# EasyEDA schematic scara_robot.json

## Sheets
1 Sheet_1: TITLE: SCARA 4DOF SCHEMATIC; REV: 3.1; Date: 13/06/2025; Sheet: 1/2; Drawn By: Lucas; Company: FEUP
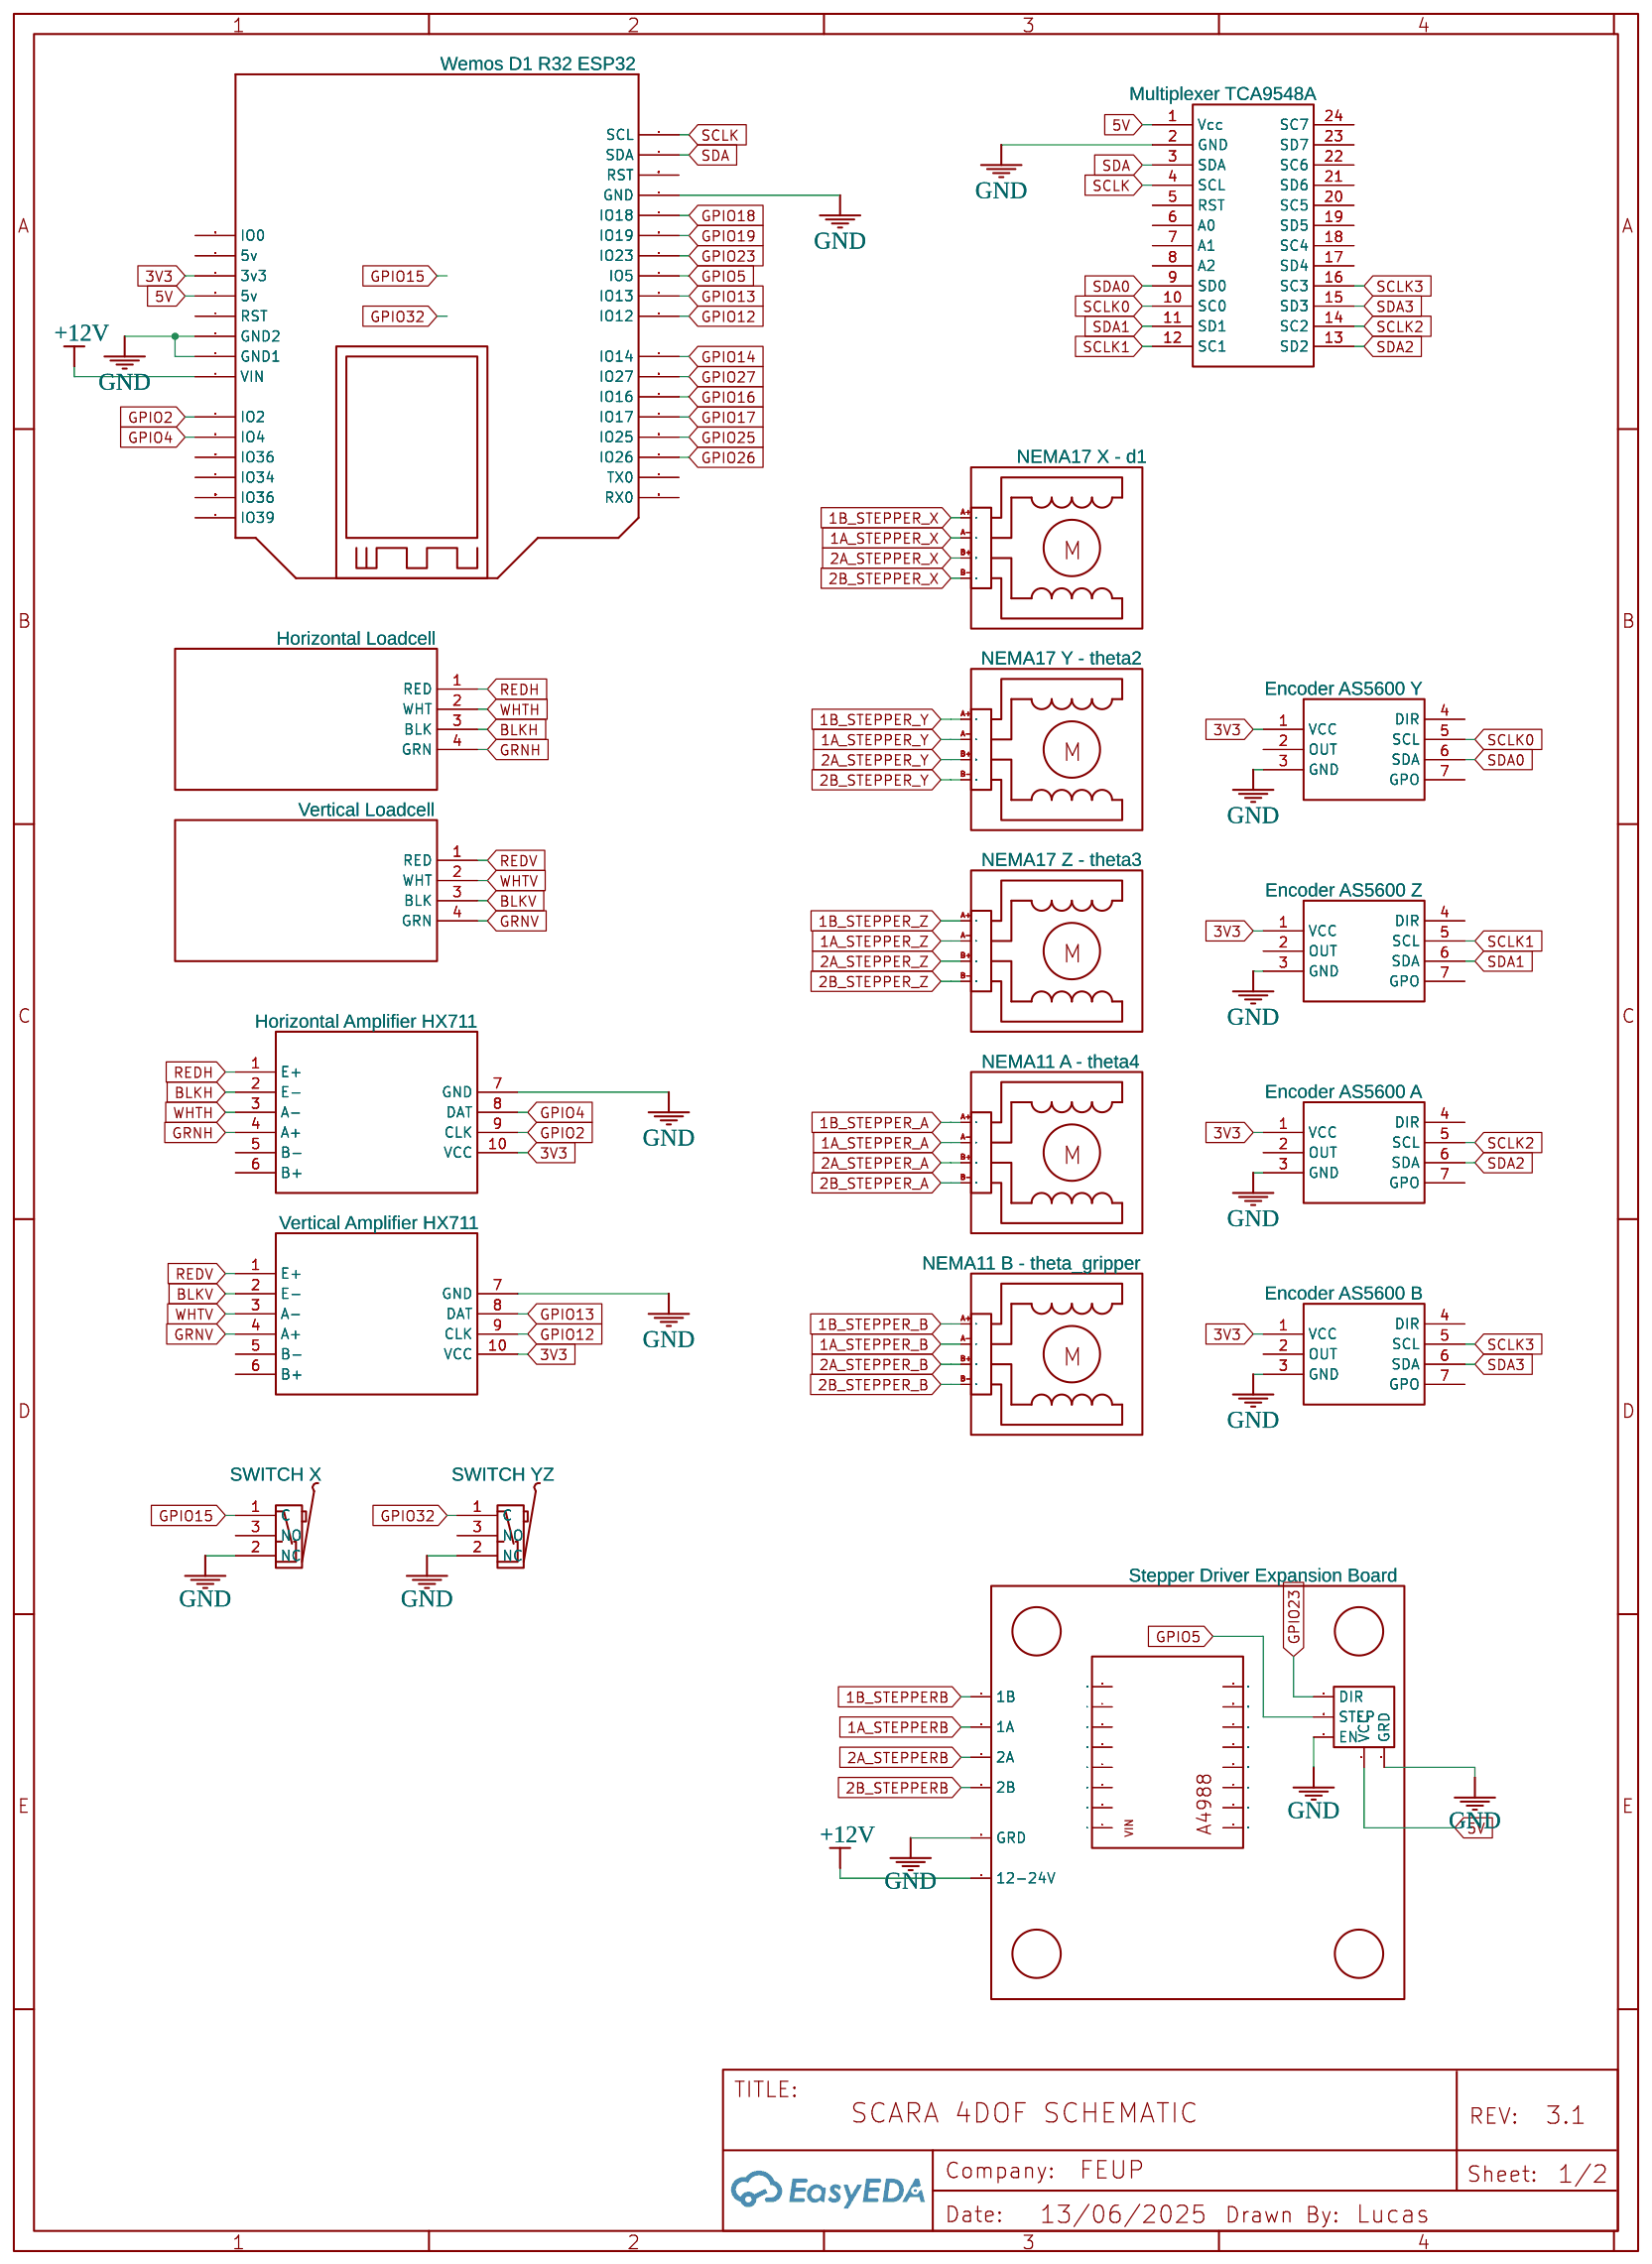
[diagram p0: Sheet_1]
2 Sheet_2: Sheet: 2/2
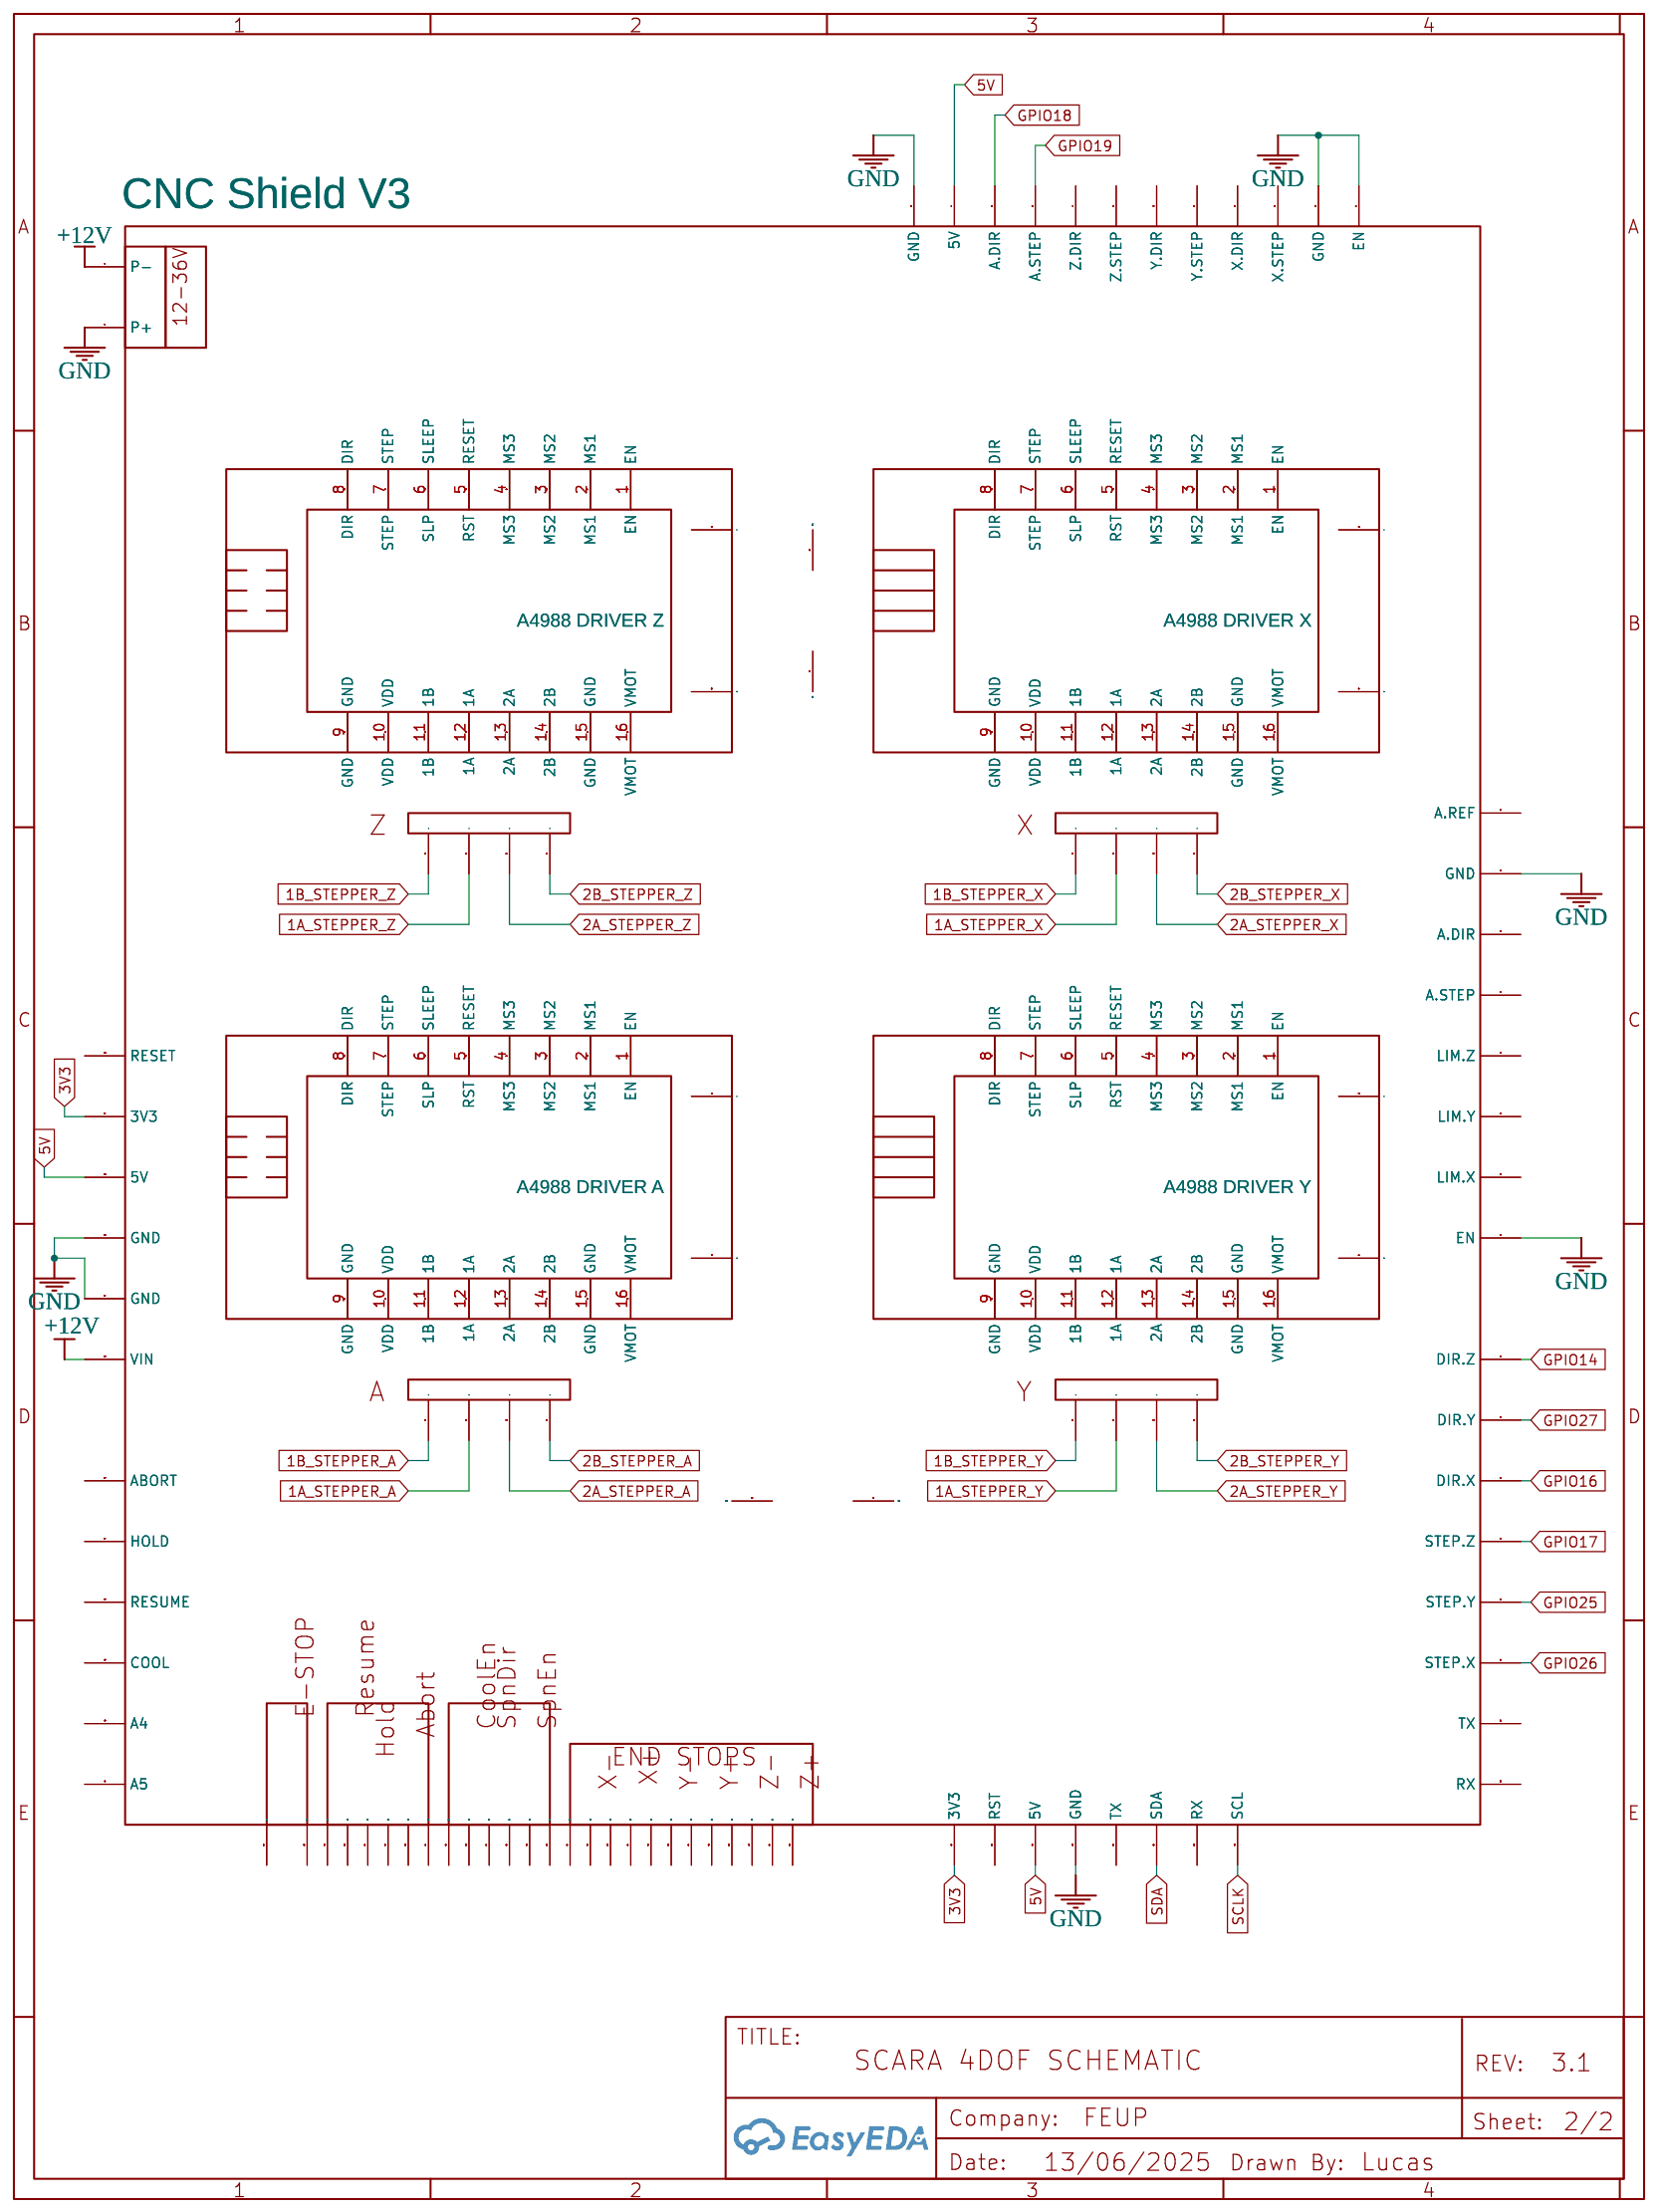
[diagram p1: Sheet_2]

## Parts
sheet Sheet_1
M1  Multiplexer TCA9548A  [S.MOD.TCA9548A]
P1  NEMA17 Y - theta2  [SOCKET FOR L9110S-H-BRIDGE-STEPPER-MOTOR-DUAL-DC-MOTOR-DRIVER-CONTROLLER-MODULE]
P2  NEMA17 X - d1  [SOCKET FOR L9110S-H-BRIDGE-STEPPER-MOTOR-DUAL-DC-MOTOR-DRIVER-CONTROLLER-MODULE]
P6  NEMA17 Z - theta3  [SOCKET FOR L9110S-H-BRIDGE-STEPPER-MOTOR-DUAL-DC-MOTOR-DRIVER-CONTROLLER-MODULE]
P7  NEMA11 A - theta4  [SOCKET FOR L9110S-H-BRIDGE-STEPPER-MOTOR-DUAL-DC-MOTOR-DRIVER-CONTROLLER-MODULE]
P8  NEMA11 B - theta_gripper  [SOCKET FOR L9110S-H-BRIDGE-STEPPER-MOTOR-DUAL-DC-MOTOR-DRIVER-CONTROLLER-MODULE]
SW1  SWITCH X  [MZ-ROLLER-MICROSWITCH]
SW2  SWITCH YZ  [MZ-ROLLER-MICROSWITCH]
U1  Wemos D1 R32 ESP32  [WEMOS]
U5  Encoder AS5600 Z  [AS5600]
U6  Encoder AS5600 A  [AS5600]
U7  Encoder AS5600 B  [AS5600]
U8  Encoder AS5600 Y  [AS5600]
U12  Horizontal Amplifier HX711  [HX711 LOAD CELL AMPLIFIER HX711 BREAKOUT]
U13  Vertical Amplifier HX711  [HX711 LOAD CELL AMPLIFIER HX711 BREAKOUT]
U14  Horizontal Loadcell
U15  Vertical Loadcell
U16  Stepper Driver Expansion Board
sheet Sheet_2
U2  CNC Shield V3  [CNC SHIELD V3]
U3  A4988 DRIVER A  [A4988 STEPPER MOTOR DRIVER CARRIER]
U4  A4988 DRIVER X  [A4988 STEPPER MOTOR DRIVER CARRIER]
U9  A4988 DRIVER Z  [A4988 STEPPER MOTOR DRIVER CARRIER]
U10  A4988 DRIVER Y  [A4988 STEPPER MOTOR DRIVER CARRIER]

## Library data of the parts
M1 = multiplexer: Supplier: TME; Contributor: rithikaakkumar
P1 P2 P6-P8 = STEPPER MOTOR AM34HD1404-06 COPY: Supplier Part: C37208; Manufacturer: BOOMELE; Manufacturer Part: Header-Male-2.54_1x6; Contributor: ethanol70
SW1 SW2 = MICROSWITCH: Contributor: robert yang
U1 = Wemos D1 R32 ESP32: WEMOS D1 R32; Contributor: C.H. WEI; Supplier: Wemos d1 r32
U5-U8 = AS5600: Manufacturer: Unknown; Manufacturer Part: Unknown; Supplier: TinyTronics; Supplier Part: 004634; link: https://www.tinytronics.nl/shop/en/sensors/magnetic-field/as5600-magnetic-angle-sensor-encoder-module; Contributor: lukevanluijn
U12 U13 = HX711 LOAD CELL AMPLIFIER: Contributor: bel_bell
U14 U15 = Loadcell: Contributor: Teknikfag
U16 = 42 STEPPER MOTOR DRIVER EXPANSION BOARD: Contributor: Guest
U2 = CNC Shield V3: Contributor: chubone
U3 U4 U9 U10 = A4988 CARRIER: Contributor: dilankrishmal; sourceId: YsmgyP7pj

## Nets
3V3: U1.3v3 U2.133(3V3) U2.167(3V3) U5.1(VCC) U6.1(VCC) U7.1(VCC) U8.1(VCC) U12.10(VCC) U13.10(VCC)
5V: M1.1(Vcc) U1.5v-2(5v) U2.4(5V) U2.135(5V) U2.166(5V) U16.24(VCC)
+12V: U1.VIN U2.1(P-) U2.163(VIN) U16.22(12-24V)
GND: M1.2(GND) SW1.2(NC) SW2.2(NC) U1.GND U1.GND1 U1.GND2 U2.2(P+) U2.3(GND) U2.13(GND) U2.14(EN) U2.136(GND) U2.142(GND) U2.148(EN) U2.164(GND) U2.165(GND) U5.3(GND) U6.3(GND) U7.3(GND) U8.3(GND) U12.7(GND) U13.7(GND) U16.21(GRD) U16.23(GRD) U16.27(EN)
1A_STEPPER_A: P7.A- U2.100(_)
1A_STEPPER_B: P8.A-
1A_STEPPER_X: P2.A- U2.39(_)
1A_STEPPER_Y: P1.A- U2.104(_)
1A_STEPPER_Z: P6.A- U2.96(_)
1A_STEPPERB: U16.18(1A)
1B_STEPPER_A: P7.A+ U2.99(_)
1B_STEPPER_B: P8.A+
1B_STEPPER_X: P2.A+ U2.38(_)
1B_STEPPER_Y: P1.A+ U2.103(_)
1B_STEPPER_Z: P6.A+ U2.95(_)
1B_STEPPERB: U16.17(1B)
2A_STEPPER_A: P7.B+ U2.101(_)
2A_STEPPER_B: P8.B+
2A_STEPPER_X: P2.B+ U2.40(_)
2A_STEPPER_Y: P1.B+ U2.105(_)
2A_STEPPER_Z: P6.B+ U2.97(_)
2A_STEPPERB: U16.19(2A)
2B_STEPPER_A: P7.B- U2.102(_)
2B_STEPPER_B: P8.B-
2B_STEPPER_X: P2.B- U2.41(_)
2B_STEPPER_Y: P1.B- U2.106(_)
2B_STEPPER_Z: P6.B- U2.98(_)
2B_STEPPERB: U16.20(2B)
BLKH: U12.2(E-) U14.3(BLK)
BLKV: U13.2(E-) U15.3(BLK)
GPIO2: U1.IO2 U12.9(CLK)
GPIO4: U1.IO4 U12.8(DAT)
GPIO5: U1.IO5 U16.26(STEP)
GPIO12: U1.IO12 U13.9(CLK)
GPIO13: U1.IO13 U13.8(DAT)
GPIO14: U1.IO14 U2.149(DIR.Z)
GPIO15: SW1.1(C)
GPIO16: U1.IO16 U2.151(DIR.X)
GPIO17: U1.IO17 U2.152(STEP.Z)
GPIO18: U1.IO18 U2.5(A.DIR)
GPIO19: U1.IO19 U2.6(A.STEP)
GPIO23: U1.IO23 U16.25(DIR)
GPIO25: U1.IO25 U2.153(STEP.Y)
GPIO26: U1.IO26 U2.154(STEP.X)
GPIO27: U1.!O27(IO27) U2.150(DIR.Y)
GPIO32: SW2.1(C)
GRNH: U12.4(A+) U14.4(GRN)
GRNV: U13.4(A+) U15.4(GRN)
REDH: U12.1(E+) U14.1(RED)
REDV: U13.1(E+) U15.1(RED)
SCLK: M1.4(SCL) U1.SCl(SCL) U2.140(SCL)
SCLK0: M1.10(SC0) U8.5(SCL)
SCLK1: M1.12(SC1) U5.5(SCL)
SCLK2: M1.14(SC2) U6.5(SCL)
SCLK3: M1.16(SC3) U7.5(SCL)
SDA: M1.3(SDA) U1.SDA U2.138(SDA)
SDA0: M1.9(SD0) U8.6(SDA)
SDA1: M1.11(SD1) U5.6(SDA)
SDA2: M1.13(SD2) U6.6(SDA)
SDA3: M1.15(SD3) U7.6(SDA)
WHTH: U12.3(A-) U14.2(WHT)
WHTV: U13.3(A-) U15.2(WHT)
Net-(U2-15): U2.15(DIR) U4.8(DIR)
Net-(U2-16): U2.16(STEP) U4.7(STEP)
Net-(U2-17): U2.17(SLEEP) U4.6(SLP)
Net-(U2-18): U2.18(RESET) U4.5(RST)
Net-(U2-19): U2.19(MS3) U4.4(MS3)
Net-(U2-20): U2.20(MS2) U4.3(MS2)
Net-(U2-21): U2.21(MS1) U4.2(MS1)
Net-(U2-22): U2.22(EN) U4.1(EN)
Net-(U2-23): U2.23(VMOT) U4.16(VMOT)
Net-(U2-24): U2.24(GND) U4.15(GND)
Net-(U2-25): U2.25(2B) U4.14(2B)
Net-(U2-26): U2.26(2A) U4.13(2A)
Net-(U2-27): U2.27(1A) U4.12(1A)
Net-(U2-28): U2.28(1B) U4.11(1B)
Net-(U2-29): U2.29(VDD) U4.10(VDD)
Net-(U2-30): U2.30(GND) U4.9(GND)
Net-(U2-42): U2.42(DIR) U9.8(DIR)
Net-(U2-43): U2.43(STEP) U9.7(STEP)
Net-(U2-44): U2.44(SLEEP) U9.6(SLP)
Net-(U2-45): U2.45(RESET) U9.5(RST)
Net-(U2-46): U2.46(MS3) U9.4(MS3)
Net-(U2-47): U2.47(MS1) U9.2(MS1)
Net-(U2-48): U2.48(EN) U9.1(EN)
Net-(U2-49): U2.49(VMOT) U9.16(VMOT)
Net-(U2-50): U2.50(GND) U9.15(GND)
Net-(U2-51): U2.51(2B) U9.14(2B)
Net-(U2-52): U2.52(2A) U9.13(2A)
Net-(U2-53): U2.53(1A) U9.12(1A)
Net-(U2-54): U2.54(1B) U9.11(1B)
Net-(U2-55): U2.55(VDD) U9.10(VDD)
Net-(U2-56): U2.56(GND) U9.9(GND)
Net-(U2-59): U2.59(DIR) U10.8(DIR)
Net-(U2-60): U2.60(STEP) U10.7(STEP)
Net-(U2-61): U2.61(SLEEP) U10.6(SLP)
Net-(U2-62): U2.62(RESET) U10.5(RST)
Net-(U2-63): U2.63(MS3) U10.4(MS3)
Net-(U2-64): U2.64(MS2) U10.3(MS2)
Net-(U2-65): U2.65(MS1) U10.2(MS1)
Net-(U2-66): U2.66(EN) U10.1(EN)
Net-(U2-67): U2.67(VMOT) U10.16(VMOT)
Net-(U2-68): U2.68(GND) U10.15(GND)
Net-(U2-69): U2.69(2B) U10.14(2B)
Net-(U2-70): U2.70(2A) U10.13(2A)
Net-(U2-71): U2.71(1A) U10.12(1A)
Net-(U2-72): U2.72(1B) U10.11(1B)
Net-(U2-73): U2.73(VDD) U10.10(VDD)
Net-(U2-74): U2.74(GND) U10.9(GND)
Net-(U2-77): U2.77(DIR) U3.8(DIR)
Net-(U2-78): U2.78(STEP) U3.7(STEP)
Net-(U2-79): U2.79(SLEEP) U3.6(SLP)
Net-(U2-80): U2.80(RESET) U3.5(RST)
Net-(U2-81): U2.81(MS3) U3.4(MS3)
Net-(U2-82): U2.82(MS2) U3.3(MS2)
Net-(U2-83): U2.83(MS1) U3.2(MS1)
Net-(U2-84): U2.84(EN) U3.1(EN)
Net-(U2-85): U2.85(VMOT) U3.16(VMOT)
Net-(U2-86): U2.86(GND) U3.15(GND)
Net-(U2-87): U2.87(2B) U3.14(2B)
Net-(U2-88): U2.88(2A) U3.13(2A)
Net-(U2-89): U2.89(1A) U3.12(1A)
Net-(U2-90): U2.90(1B) U3.11(1B)
Net-(U2-91): U2.91(VDD) U3.10(VDD)
Net-(U2-92): U2.92(GND) U3.9(GND)
Net-(U2-169): U2.169(MS2) U9.3(MS2)

Not connected (* = marked no-connect by the designer): M1 5(RST) 6(A0) 7(A1) 8(A2) 17(SD4) 18(SC4) 19(SD5) 20(SC5) 21(SD6) 22(SC6) 23(SD7) 24(SC7); SW1 3(NO); SW2 3(NO); U1 5v-1(5v) -1(RST) IO0 IO34 IO36-1(IO36) IO36-2(IO36) IO39 RST-2(RST) RX0 TX0; U2 7(Z.DIR) 8(Z.STEP) 9(Y.DIR) 10(Y.STEP) 11(X.DIR) 12(X.STEP) 36(_) 37(+) 57(_) 58(+) 75(_) 76(+) 93(_) 94(+) 107(13) 108(14) 109(15) 110(16) 111(17) 112(18) 113(19) 114(20) 115(21) 116(22) 117(23) 118(24) 119(25) 120(26) 121(27) 122(28) 123(29) 124(30) 125(31) 126(32) 127(33) 128(34) 129(35) 130(36) 131(37) 132(38) 134(RST) 137(TX) 139(RX) 141(A.REF) 143(A.DIR) 144(A.STEP) 145(LIM.Z) 146(LIM.Y) 147(LIM.X) 155(TX) 156(RX) 157(A5) 158(A4) 159(COOL) 160(RESUME) 161(HOLD) 162(ABORT) 168(RESET) 170(RESET) 171(RESET) 172(RESET) 173(RESET); U5 2(OUT) 4(DIR) 7(GPO); U6 2(OUT) 4(DIR) 7(GPO); U7 2(OUT) 4(DIR) 7(GPO); U8 2(OUT) 4(DIR) 7(GPO); U12 5(B-) 6(B+); U13 5(B-) 6(B+); U16 1 2 3 4 5 6 7 8 9 10 11 12 13 14 15 16
